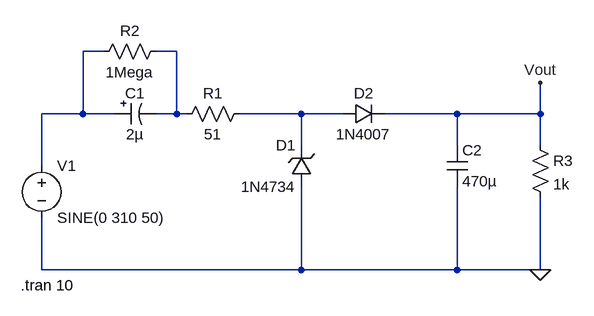
[diagram p0: schematic Transformerless_5 .asc]
Transformerless_5 .asc, the LTspice schematic file:
Version 4
SHEET 1 956 680
WIRE 176 -32 144 -32
WIRE 288 -32 256 -32
WIRE 144 64 144 -32
WIRE 144 64 80 64
WIRE 192 64 144 64
WIRE 288 64 288 -32
WIRE 288 64 256 64
WIRE 304 64 288 64
WIRE 480 64 384 64
WIRE 544 64 480 64
WIRE 720 64 608 64
WIRE 848 64 848 16
WIRE 848 64 720 64
WIRE 480 112 480 64
WIRE 720 112 720 64
WIRE 848 112 848 64
WIRE 80 144 80 64
WIRE 80 304 80 224
WIRE 480 304 480 176
WIRE 480 304 80 304
WIRE 720 304 720 176
WIRE 720 304 480 304
WIRE 848 304 848 192
WIRE 848 304 720 304
FLAG 848 304 0
FLAG 848 16 Vout
SYMBOL voltage 80 128 R0
WINDOW 123 0 0 Left 0
WINDOW 39 0 0 Left 0
SYMATTR InstName V1
SYMATTR Value SINE(0 310 50)
SYMBOL polcap 192 48 M90
WINDOW 0 0 32 VBottom 2
WINDOW 3 32 32 VTop 2
SYMATTR InstName C1
SYMATTR Value 2µ
SYMATTR Description Capacitor
SYMATTR Type cap
SYMATTR SpiceLine V=275
SYMBOL res 400 48 R90
WINDOW 0 0 56 VBottom 2
WINDOW 3 32 56 VTop 2
SYMATTR InstName R1
SYMATTR Value 51
SYMATTR SpiceLine pwr=3
SYMBOL res 272 -48 R90
WINDOW 0 0 56 VBottom 2
WINDOW 3 32 56 VTop 2
SYMATTR InstName R2
SYMATTR Value 1Mega
SYMBOL zener 496 176 R180
WINDOW 0 24 64 Left 2
WINDOW 3 24 0 Left 2
SYMATTR InstName D1
SYMATTR Value 1N4734
SYMBOL diode 544 80 R270
WINDOW 0 32 32 VTop 2
WINDOW 3 0 32 VBottom 2
SYMATTR InstName D2
SYMATTR Value 1N4007
SYMBOL cap 704 112 R0
SYMATTR InstName C2
SYMATTR Value 470µ
SYMBOL res 832 96 R0
SYMATTR InstName R3
SYMATTR Value 1k
TEXT 48 328 Left 2 !.tran 10

The netlist it stands for:
* Transformerless_5 .asc
V1 N001 0 SINE(0 310 50)
C1 N001 N002 2µ V=275
R1 N003 N002 51 pwr=3
R2 N002 N001 1Mega
D1 0 N003 1N4734
D2 N003 Vout 1N4007
C2 Vout 0 470µ
R3 Vout 0 1k
.model D D
.lib standard.dio
.tran 10
.backanno
.end